# Altium schematic sheet Power.SchDoc
size A; DocumentNumber: 5; SheetNumber: 5; SheetTotal: 5
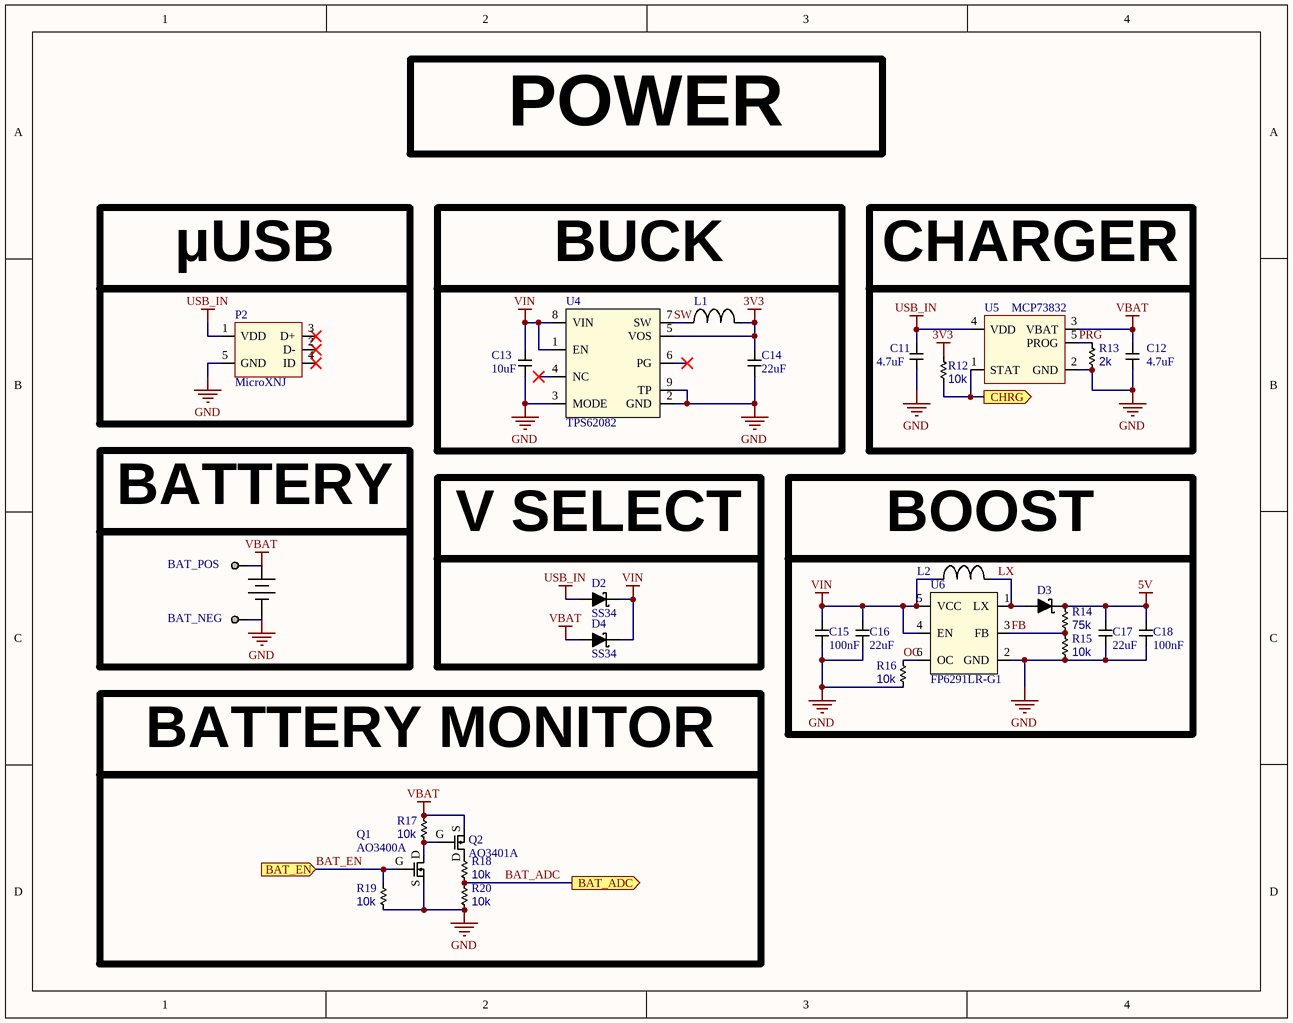
[diagram p0: Power.SchDoc]

## Parts
BAT_NEG  18 AWG Hole  [18 AWG Hole]  (value not drawn)  (no BOM)
BAT_POS  18 AWG Hole  [18 AWG Hole]  (value not drawn)  (no BOM)
C11  4.7uF  [CAP_0402_HIGH]
C12  4.7uF  [CAP_0402_HIGH]
C13  10uF  [CAP_0603_HIGH]
C14  22uF  [CAP_0603_HIGH]
C15  100nF  [CAP_0402_HIGH]
C16  22uF  [CAP_0603_HIGH]
C17  22uF  [CAP_0603_HIGH]
C18  100nF  [CAP_0402_HIGH]
D2  SS34  [SS34]
D3  SS34  [SS34]  (value not drawn)
D4  SS34  [SS34]
L1  YNR3015-2R2M  [YNR3015-2R2M]  (value not drawn)
L2  VLS3015ET-3R3M  [VLS3015ET-3R3M]  (value not drawn)
P2  MicroXNJ  [MicroXNJ]
Q1  AO3400A  [AO3400A]
Q2  AO3401A  [AO3401A]
R12  10k  [RES_0402_HIGH]
R13  2k  [RES_0402_HIGH]
R14  75k  [RES_0402_HIGH]
R15  10k  [RES_0402_HIGH]
R16  10k  [RES_0402_HIGH]
R17  10k  [RES_0402_HIGH]
R18  10k  [RES_0402_HIGH]
R19  10k  [RES_0402_HIGH]
R20  10k  [RES_0402_HIGH]
U4  TPS62082  [TPS62082]
U5  MCP73832  [MCP73831]
U6  FP6291LR-G1  [FP6291LR-G1]

## Ports
BAT_ADC (out), BAT_EN (in), CHRG (out)

## Nets
3V3: C14.2 L1.2 R12.1 U4.5(VOS)
5V: C17.2 C18.2 D3.2 R14.1
GND: BAT_NEG.1 C11.1 C12.1 C13.1 C14.1 C15.1 C16.1 C17.1 C18.1 P2.5(GND) Q1.S R13.2 R15.2 R16.2 R19.2 R20.2 U4.2(GND) U4.3(MODE) U4.9(TP) U5.2(GND) U6.2(GND)
USB_IN: C11.2 D2.1 P2.1(VDD) U5.4(VDD)
VBAT: BAT_POS.1 C12.2 D4.1 Q2.S R17.1 U5.3(VBAT)
VIN: C13.2 C15.2 C16.2 D2.2 D4.2 L2.1 U4.1(EN) U4.8(VIN) U6.4(EN) U6.5(VCC)
BAT_ADC: R18.2 R20.1 ; port BAT_ADC
BAT_EN: Q1.G R19.1 ; port BAT_EN
CHRG: R12.2 U5.1(STAT) ; port CHRG
FB: R14.2 R15.1 U6.3(FB)
LX: D3.1 L2.2 U6.1(LX)
OC: R16.1 U6.6(OC)
PRG: R13.1 U5.5(PROG)
SW: L1.1 U4.7(SW)
NetQ1_D: Q1.D Q2.G R17.2
NetQ2_D: Q2.D R18.1

Not connected (* = marked no-connect by the designer): P2 2(D-)* 3(D+)* 4(ID)*; U4 4(NC)* 6(PG)*

## Notes on the sheet
- POWER
- (near P2) μUSB
- BUCK
- CHARGER
- (near BAT_POS) BATTERY
- (near D2) V SELECT
- (near L2) BOOST
- BATTERY MONITOR

## Library data of the parts
C11 C12 C15 C18 = Capacitor_0402: 0402 Capacitor
C13 C14 C16 C17 = Capacitor_0603: 0603 Capacitor
D2-D4 = SS34: SS34 40V 3A 550mV @ 3A SMA(DO-214AC) Schottky Barrier Diodes (SBD) ROHS
L1 = YNR3015-2R2M: YNR3015-2R2M 2.2uH ±20% 1.6A 30mΩ SMD,3.0x3.0x1.5mm Power Inductors RoHS
L2 = VLS3015ET-3R3M: VLS3015ET-3R3M 3.3 µH Shielded Wirewound Inductor 1.15 A 112mOhm Max Nonstandard
P2 = MicroXNJ: MicroXNJ USB - micro B USB 2.0 Receptacle Connector 5 Position Surface Mount, Right Angle; Through Hole
Q1 = AO3400A: AO3400A N-Channel 30 V 5.7A (Ta) 1.4W (Ta) Surface Mount SOT-23-3
Q2 = AO3401A: AO3401A MOSFET P-CH 30V 4A SOT23
R12-R20 = Resistor_0402: 0402 Resistor
U4 = TPS62082: TPS62082 Buck Switching Regulator IC Positive Fixed 3.3V 1 Output 1.2A 8-WFDFN Exposed Pad
U5 = MCP73831: MCP73831 Charger IC Lithium-Ion/Polymer
U6 = FP6291LR-G1: FP6291LR-G1 2A 5.5V SOT-23-6 DC-DC Converters ROHS